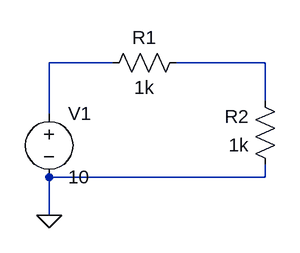
[diagram p0: schematic Simple voltage divider.asc]
Simple voltage divider.asc, the LTspice schematic file:
Version 4.1
SHEET 1 880 680
WIRE 128 128 48 128
WIRE 320 128 208 128
WIRE 320 176 320 128
WIRE 48 192 48 128
WIRE 320 272 320 256
WIRE 320 272 48 272
WIRE 48 320 48 272
FLAG 48 320 0
SYMBOL res 224 112 R90
WINDOW 0 0 56 VBottom 2
WINDOW 3 32 56 VTop 2
SYMATTR InstName R1
SYMATTR Value 1k
SYMBOL res 336 272 R180
WINDOW 0 36 76 Left 2
WINDOW 3 36 40 Left 2
SYMATTR InstName R2
SYMATTR Value 1k
SYMBOL voltage 48 176 R0
WINDOW 123 0 0 Left 0
WINDOW 39 0 0 Left 0
SYMATTR InstName V1
SYMATTR Value 10

The netlist it stands for:
* Simple voltage divider.asc
R1 N002 N001 1k
R2 0 N002 1k
V1 N001 0 10
.backanno
.end